# Altium schematic sheet 02_USB_MCU.SchDoc: USB & Microcontroller
size A4; Date: 08/06/2019; Author: Luis Sánchez Velasco; DocumentNumber: 2; Revision: 0; SheetNumber: 2; SheetTotal: 4; sheet_title: USB Microcontroller
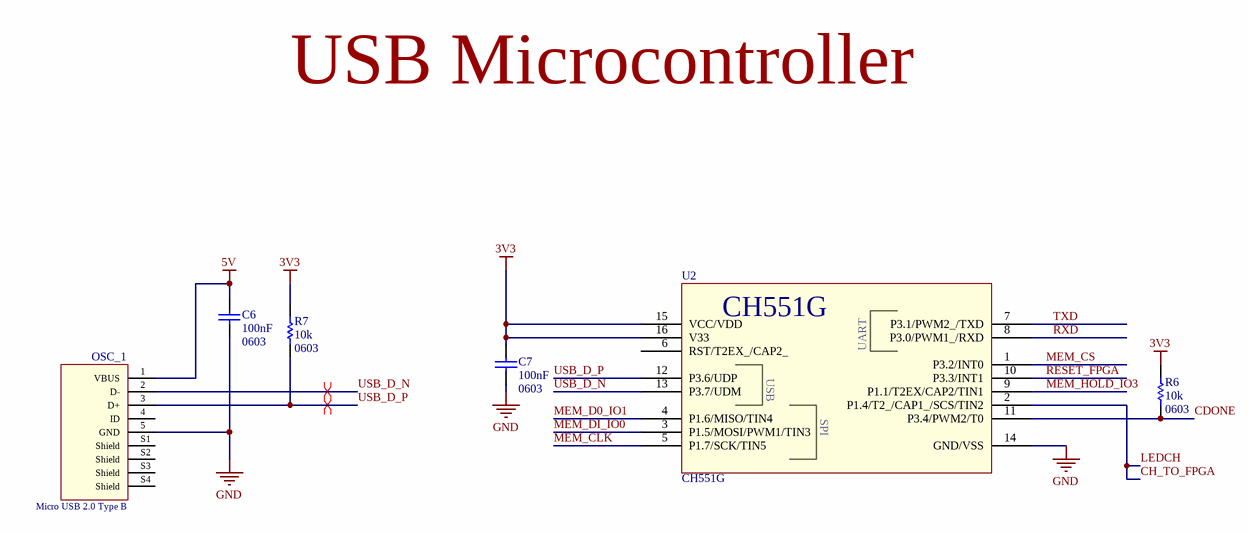
[diagram p0: 02_USB_MCU.SchDoc]

## Parts
C6  value 100nF  Package: 0603  [0603 CAP]  (hidden comment: Ceramic capacitor)
C7  value 100nF  Package: 0603  [0603 CAP]  (hidden comment: Ceramic capacitor)
OSC_1  Micro USB 2.0 Type B  [629105136821]
R6  value 10k  Package: 0603  [Resistencia 0603]  (hidden comment: Resistor)
R7  value 10k  Package: 0603  [Resistencia 0603]  (hidden comment: Resistor)
U2  CH551G  [CH551]

## Nets
3V3: C7.1 R6.2 R7.1 U2.15(VCC/VDD) U2.16(V33)
5V: C6.1 OSC_1.1(VBUS)
GND: C6.2 C7.2 OSC_1.5(GND) U2.14(GND/VSS)
CDONE: R6.1 U2.11(P3.4/PWM2/T0)
CH_TO_FPGA: U2.2(P1.4/T2_/CAP1_/SCS/TIN2)  [also labelled LEDCH]
MEM_CLK: U2.5(P1.7/SCK/TIN5)
MEM_CS: U2.1(P3.2/INT0)
MEM_D0_IO1: U2.4(P1.6/MISO/TIN4)
MEM_DI_IO0: U2.3(P1.5/MOSI/PWM1/TIN3)
MEM_HOLD_IO3: U2.9(P1.1/T2EX/CAP2/TIN1)
RESET_FPGA: U2.10(P3.3/INT1)
RXD: U2.8(P3.0/PWM1_/RXD)
TXD: U2.7(P3.1/PWM2_/TXD)
USB_D_N: OSC_1.2(D-) U2.13(P3.7/UDM)
USB_D_P: OSC_1.3(D+) R7.2 U2.12(P3.6/UDP)

Not connected (* = marked no-connect by the designer): OSC_1 4(ID) S1(Shield) S2(Shield) S3(Shield) S4(Shield); U2 6(RST/T2EX_/CAP2_)

## Layout directives
differential pair: USB_D_N, USB_D_P

## Notes on the sheet
- USB Microcontroller
- Sheet title:
- Project title:
- Desginer:
- The hardcore audio processor
- RocketFPGA
- Date:
- Revision:
- Sheet
- of
- (in symbol CH551G) UART; USB; SPI

## Library data of the parts
C6 C7 = Capacitor: vendor: LCSC; vendorID: 0603F104M500NT; Supplier 1: Mouser; Supplier Part Number 1: 80-C1206C104K5R; ManufacturerReference: -; price: 0.0023
OSC_1 = 629105136821: Micro USB 2.0 Type B Horizontal SMT 5 Contacts WR-COM; Vendor: LCSC; Vendor 2: Mouser; Link: https://lcsc.com/product-detail/USB-Connectors_Jing-Extension-of-the-Electronic-Co-Jing-Extension-of-the-Electronic-Co-micro-5PAll-posts-are-not-guided-Flat-welding-High-temperature_C77238.html; ComponentLink1Description: Manufacturer; ComponentLink1URL: http://www.we-online.de; ComponentLink2Description: Datasheet; ComponentLink2URL: http://katalog.we-online.de/em/datasheet/629105136821.pdf; Link 2: https://www.mouser.es/ProductDetail/Wurth-Elektronik/629105136821?qs=%2Fha2pyFaduiBjBt32de63eUvWSiL1Vrl53OTMO%252B7qnQKl4r3Xe3wDQ%3D%3D
R6 R7 = Resistor: vendor: LCSC; vendorID: 0603WAF1002T5E; Supplier 1: Farnell; Supplier Part Number 1: 2358436; ManufacturerReference: -; price: 0.0009
  R6: Parameter 1: *
U2 = CH551G: Microcontroller wUSB support; Vendor: LCSC; ComponentLink1Description: LCSC; ComponentLink1URL: https://lcsc.com/product-detail/USB_CH551G_C108958.html; Link: https://lcsc.com/product-detail/WCH_WCH-Jiangsu-Qin-Heng-CH551G_C108958.html